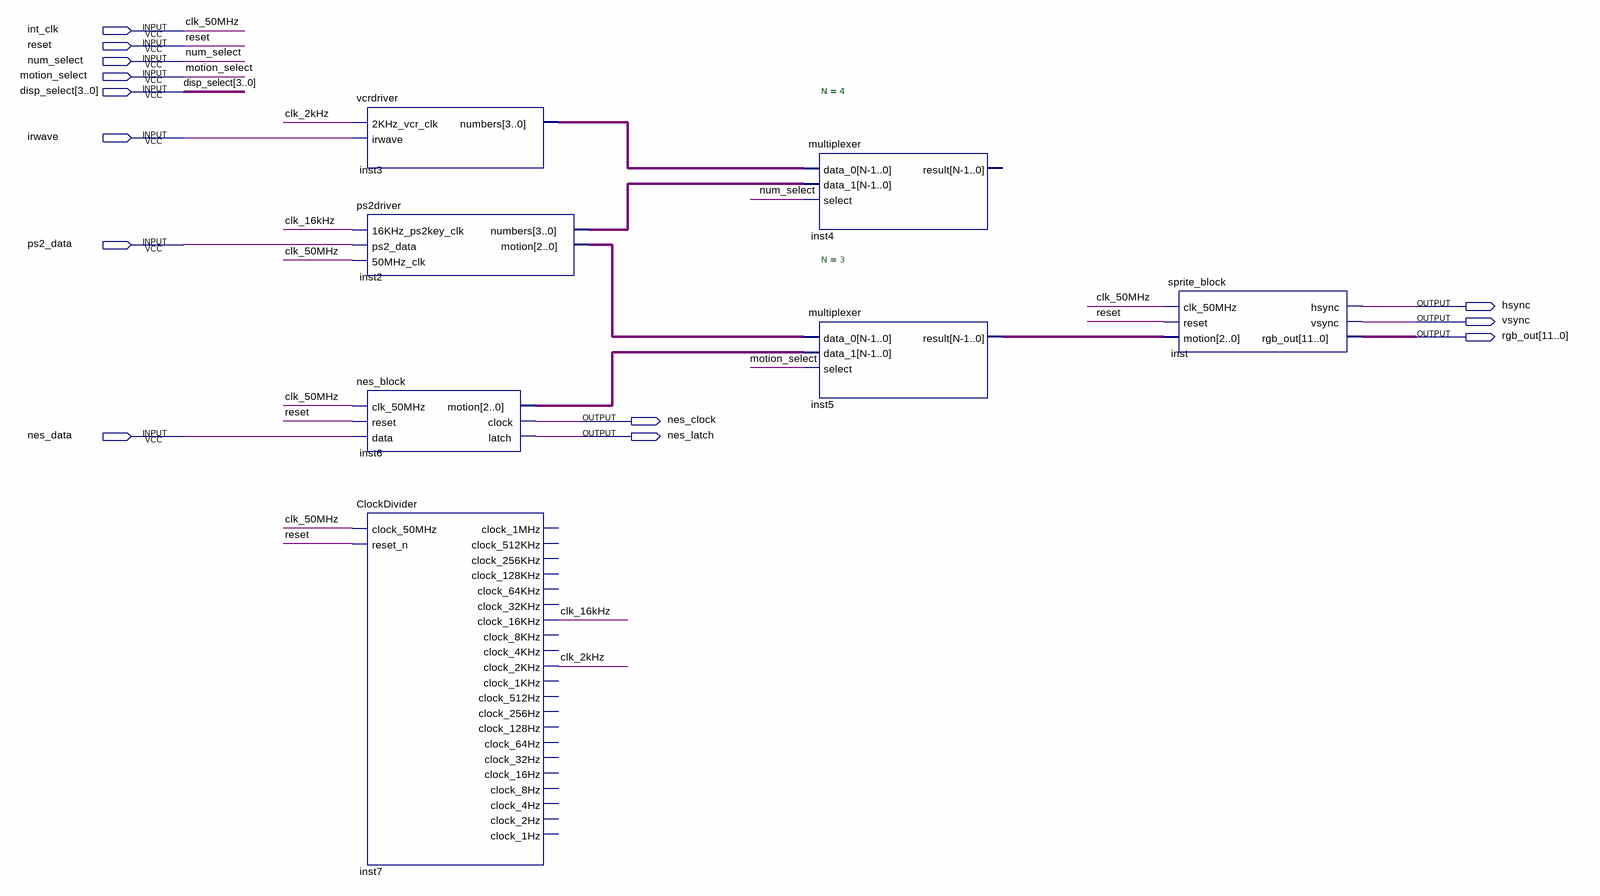
[diagram p0: schematic sheet]
// Quartus schematic designproj.bdf as structural Verilog: 7 symbols, 13 pins
module designproj (
  input  int_clk,
  input  reset,
  input  num_select,
  input  motion_select,
  input  [3:0] disp_select,
  input  irwave,
  input  ps2_data,
  input  nes_data,
  output hsync,
  output vsync,
  output [11:0] rgb_out,
  output nes_clock,
  output nes_latch
);

  wire clk_2kHz, clk_16kHz;
  wire [2:0] inst2_motion, inst5_result, inst6_motion;
  wire [3:0] inst2_numbers, inst3_numbers;

  vcrdriver inst3 (.\2KHz_vcr_clk (clk_2kHz), .irwave(irwave), .numbers(inst3_numbers));
  ps2driver inst2 (
    .\16KHz_ps2key_clk (clk_16kHz), .ps2_data(ps2_data), .\50MHz_clk (int_clk), .numbers(inst2_numbers),
    .motion(inst2_motion));
  nes_block inst6 (
    .clk_50MHz(int_clk), .reset(reset), .data(nes_data), .motion(inst6_motion), .clock(nes_clock),
    .latch(nes_latch));
  ClockDivider inst7 (
    .clock_50MHz(int_clk), .reset_n(reset), .clock_16KHz(clk_16kHz), .clock_2KHz(clk_2kHz));  // open: clock_1MHz, clock_512KHz, clock_256KHz, clock_128KHz, clock_64KHz, clock_32KHz, clock_8KHz, clock_4KHz, clock_1KHz, clock_512Hz, clock_256Hz, clock_128Hz, clock_64Hz, clock_32Hz, clock_16Hz, clock_8Hz, clock_4Hz, clock_2Hz, clock_1Hz
  multiplexer #(.N(4)) inst4 (.data_0(inst3_numbers), .data_1(inst2_numbers), .select(num_select));  // open: result
  multiplexer #(.N(3)) inst5 (
    .data_0(inst2_motion), .data_1(inst6_motion), .select(motion_select), .result(inst5_result));
  sprite_block inst (
    .clk_50MHz(int_clk), .reset(reset), .motion(inst5_result), .hsync(hsync), .vsync(vsync), .rgb_out(rgb_out));

  // Other names for the same wires on the sheet: clk_50MHz = int_clk
endmodule
